# EAGLE schematic smartwing1 (EAGLE 9.6.1)
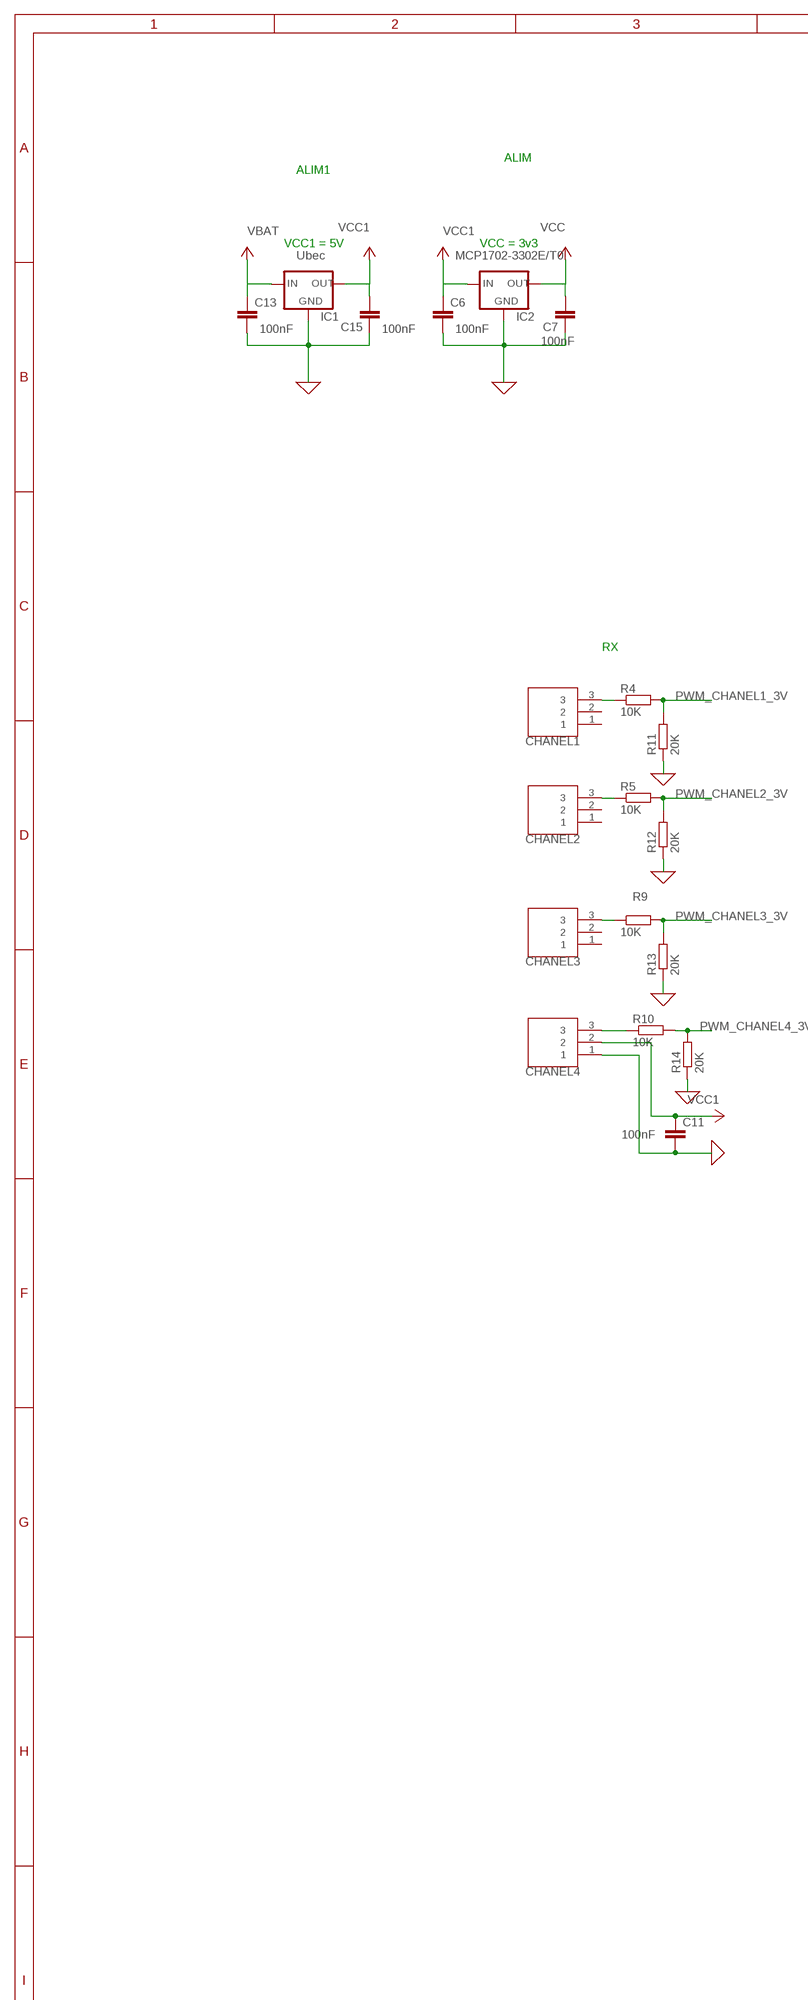
[diagram p0: schematic, sheet 1, part 1 of 2]
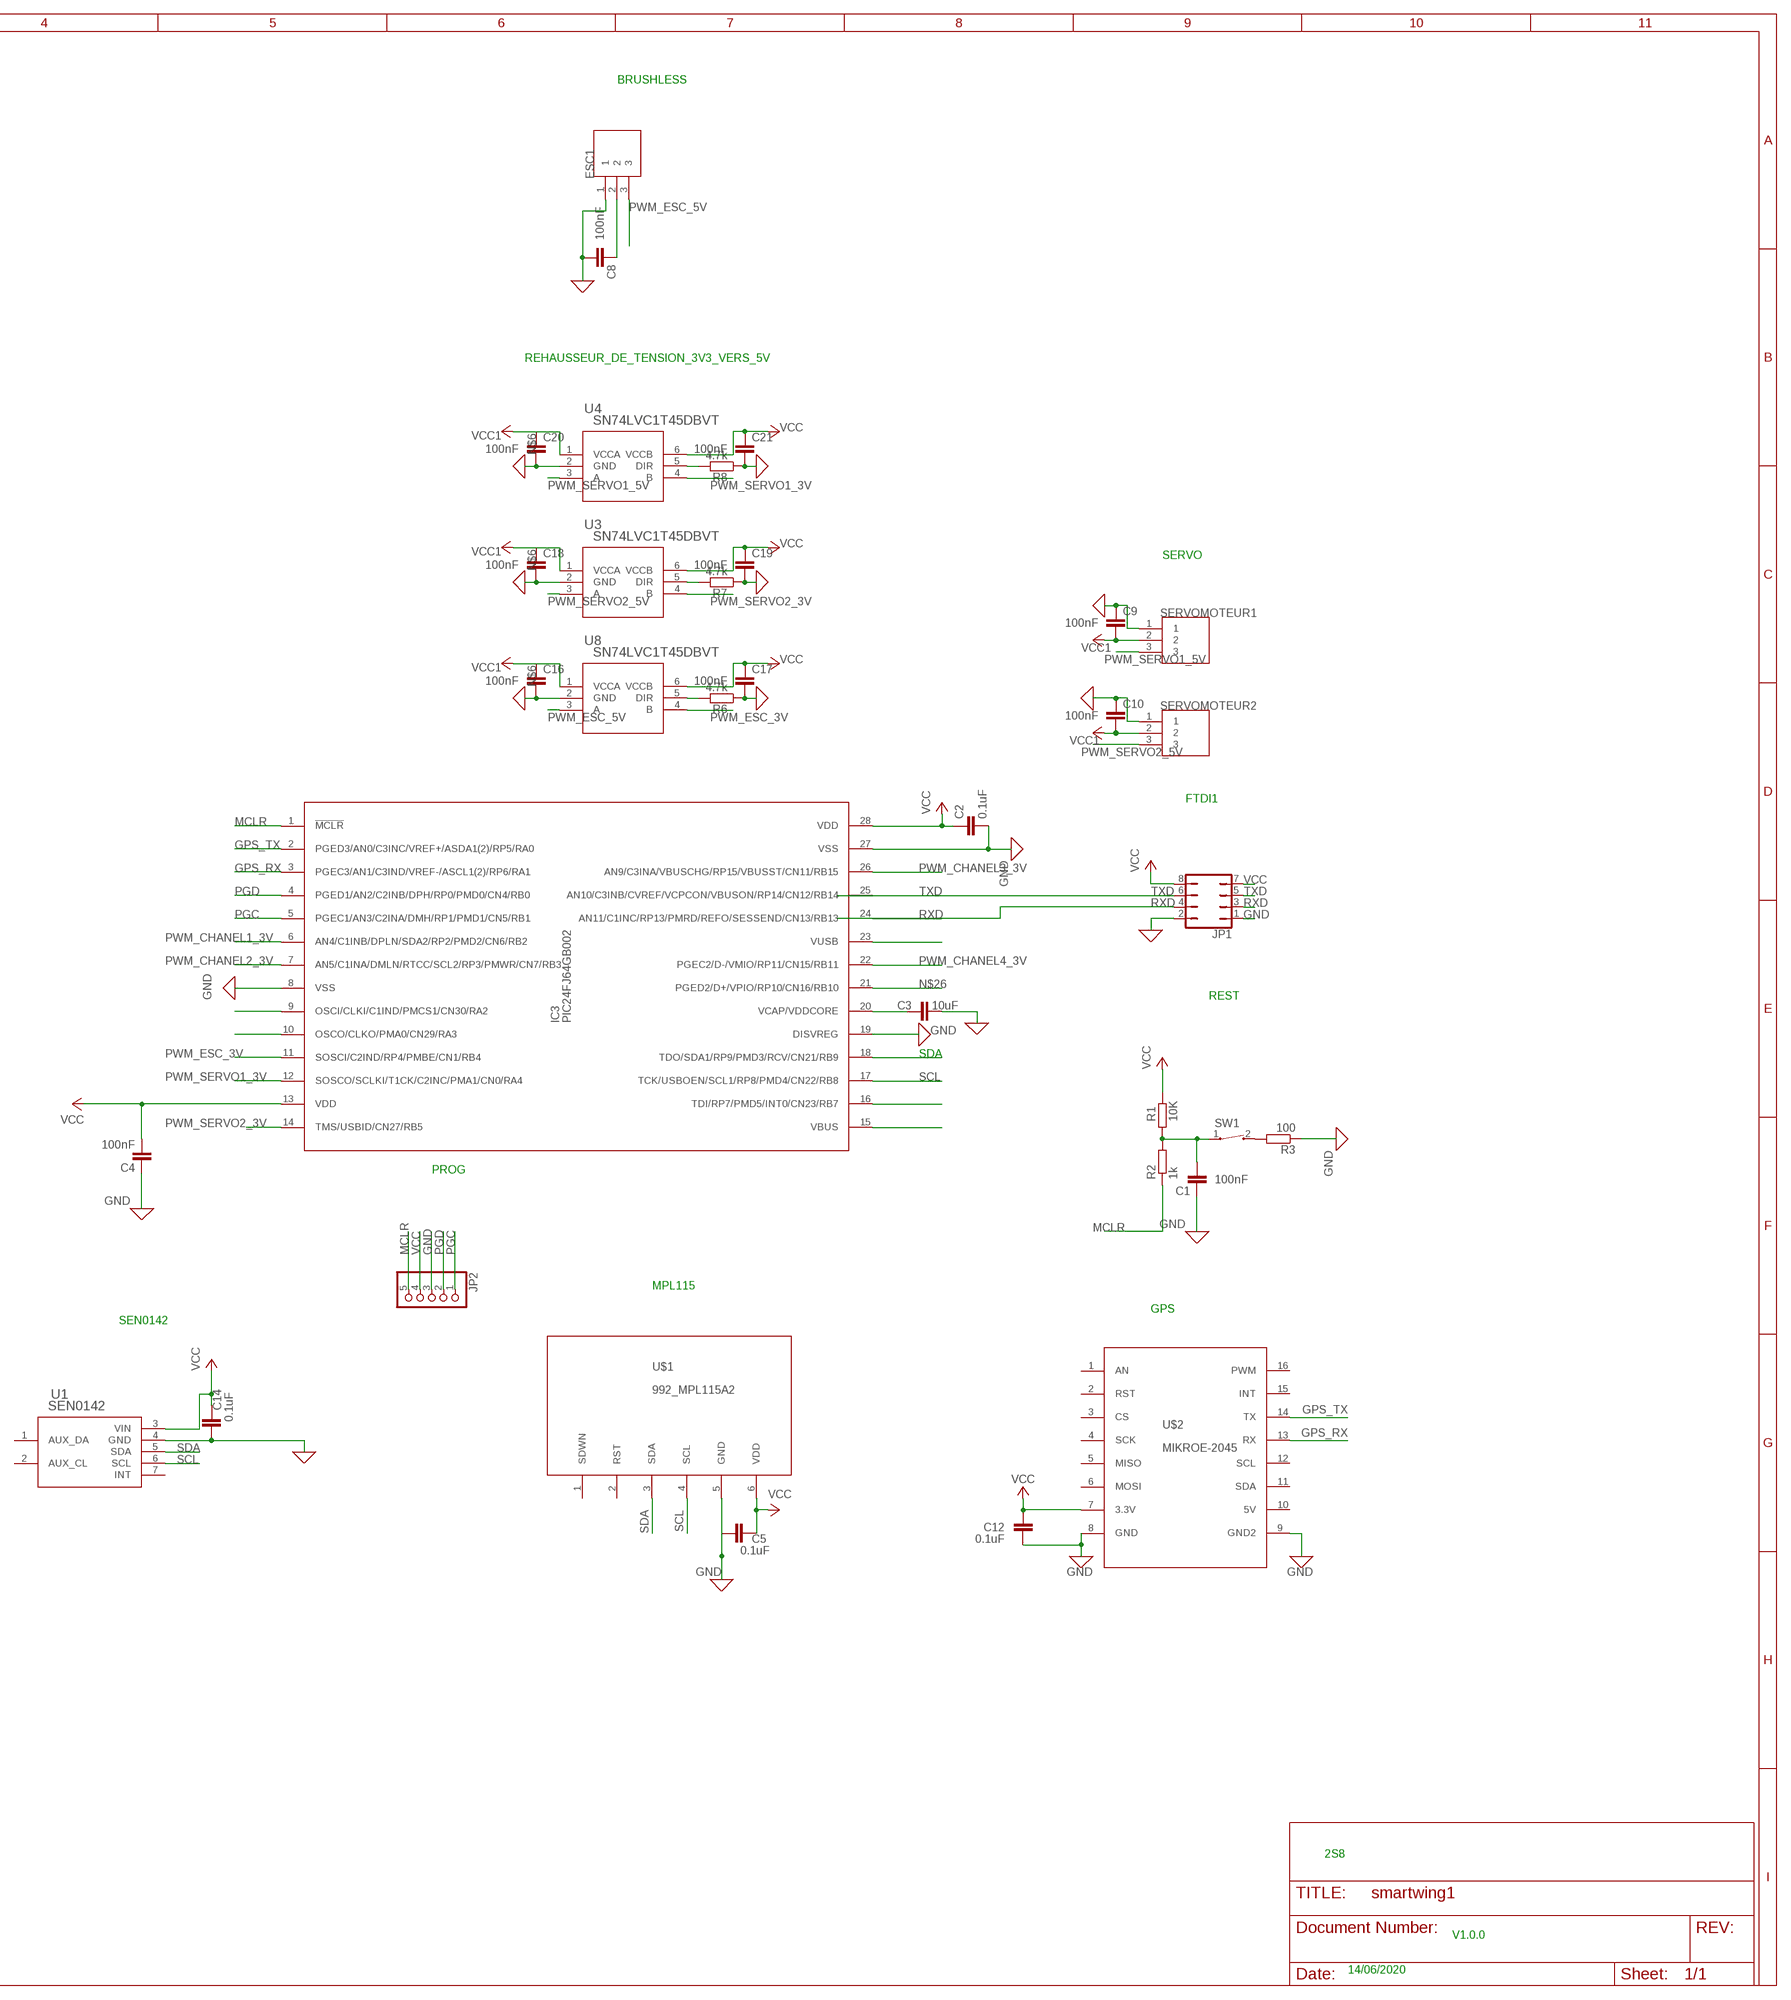
[diagram p1: schematic, sheet 1, part 2 of 2]

## Parts
C1  100nF  C-EU075-032X103  [C075-032X103]
C2  0.1uF  C-EU075-032X103  [C075-032X103]
C3  10uF  C-EU075-032X103  [C075-032X103]
C4  100nF  C-EU075-032X103  [C075-032X103]
C5  0.1uF  C-EU075-032X103  [C075-032X103]
C6  100nF  C-EU075-032X103  [C075-032X103]
C7  100nF  C-EU075-032X103  [C075-032X103]
C8  100nF  C-EU075-032X103  [C075-032X103]
C9  100nF  C-EU075-032X103  [C075-032X103]
C10  100nF  C-EU075-032X103  [C075-032X103]
C11  100nF  C-EU075-032X103  [C075-032X103]
C12  0.1uF  C-EU075-032X103  [C075-032X103]
C13  100nF  C-EU075-032X103  [C075-032X103]
C14  0.1uF  C-EU075-032X103  [C075-032X103]
C15  100nF  C-EU075-032X103  [C075-032X103]
C16  100nF  C-EU075-032X103  [C075-032X103]
C17  100nF  C-EU075-032X103  [C075-032X103]
C18  100nF  C-EU075-032X103  [C075-032X103]
C19  100nF  C-EU075-032X103  [C075-032X103]
C20  100nF  C-EU075-032X103  [C075-032X103]
C21  100nF  C-EU075-032X103  [C075-032X103]
CHANEL1  826926-3  [TE_826926-3]
CHANEL2  826926-3  [TE_826926-3]
CHANEL3  826926-3  [TE_826926-3]
CHANEL4  826926-3  [TE_826926-3]
ESC1  826926-3  [TE_826926-3]
IC1  Ubec  78LXX  [78LXX]
IC2  MCP1702-3302E/T0  78LXX  [78LXX]
IC3  PIC24FJ64GB002  [DIL28-3]
JP1  JP4Q  [JP4Q]
JP2  PINHD-1X5  [1X05]
R1  10K  R-EU_0204/5  [0204/5]
R2  1k  R-EU_0204/5  [0204/5]
R3  100  R-EU_0204/5  [0204/5]
R4  10K  R-EU_0204/5  [0204/5]
R5  10K  R-EU_0204/5  [0204/5]
R6  4.7k  R-EU_0207/7  [0207/7]
R7  4.7k  R-EU_0207/7  [0207/7]
R8  4.7k  R-EU_0207/7  [0207/7]
R9  10K  R-EU_0204/5  [0204/5]
R10  10K  R-EU_0204/5  [0204/5]
R11  20K  R-EU_0204/5  [0204/5]
R12  20K  R-EU_0204/5  [0204/5]
R13  20K  R-EU_0204/5  [0204/5]
R14  20K  R-EU_0204/5  [0204/5]
SERVOMOTEUR1  826926-3  [TE_826926-3]
SERVOMOTEUR2  826926-3  [TE_826926-3]
SW1  CT10-XXXX-A2  [CT10-XXXX-A2]
U1  SEN0142  [SEN0142]
U3  SN74LVC1T45DBVT  [DBV6_TEX]
U4  SN74LVC1T45DBVT  [DBV6_TEX]
U8  SN74LVC1T45DBVT  [DBV6_TEX]
U$1  992_MPL115A2  [1X06]
U$2  MIKROE-2045  [2X08]

## Nets
0: C3.2 C8.2 C9.1 C10.1 C11.2 C14.2 C17.2 C19.2 C21.2 CHANEL4.1 ESC1.1 JP1.2 R6.1 R7.1 R8.1 R11.1 R12.1 R13.1 R14.1 SERVOMOTEUR1.1 SERVOMOTEUR2.1 U1.4(GND) U$2.9(GND2) ; supply symbol labelled GND
100NF: C6.2 C7.1 IC2.GND ; supply symbol labelled GND
GND: C1.1 C2.2 C4.1 C5.2 C12.2 IC3.8(VSS) IC3.19(DISVREG) IC3.27(VSS) JP1.1 JP2.3 R3.1 U$1.5(GND) U$2.8(GND)
GPS_RX: IC3.3(PGEC3/AN1/C3IND/VREF-/ASCL1(2)/RP6/RA1) U$2.13(RX)
GPS_TX: IC3.2(PGED3/AN0/C3INC/VREF+/ASDA1(2)/RP5/RA0) U$2.14(TX)
MCLR: IC3.1(!MCLR) JP2.5 R2.1
N$1: IC3.16(TDI/RP7/PMD5/INT0/CN23/RB7)
N$2: C3.1 IC3.20(VCAP/VDDCORE)
N$3: C16.1 C18.1 C20.1 U3.1(VCCA) U4.1(VCCA) U8.1(VCCA) ; supply symbol labelled VCC1
N$4: R7.2 U3.5(DIR)
N$5: C1.2 R1.1 R2.2 SW1.1
N$6: C13.2 C15.1 C16.2 C18.2 C20.2 IC1.GND U3.2(GND) U4.2(GND) U8.2(GND) ; supply symbol labelled GND
N$7: R3.2 SW1.2
N$8: C7.2 C15.2 IC1.OUT IC2.OUT ; supply symbol labelled VCC, VCC1
N$9: R8.2 U4.5(DIR)
N$11: R6.2 U8.5(DIR)
N$13: C17.1 C19.1 C21.1 U3.6(VCCB) U4.6(VCCB) U8.6(VCCB) ; supply symbol labelled VCC
N$17: C4.2 IC3.13(VDD) ; supply symbol labelled VCC
N$22: IC3.15(VBUS)
N$26: IC3.21(PGED2/D+/VPIO/RP10/CN16/RB10)
N$28: IC3.23(VUSB)
PGC: IC3.5(PGEC1/AN3/C2INA/DMH/RP1/PMD1/CN5/RB1) JP2.1
PGD: IC3.4(PGED1/AN2/C2INB/DPH/RP0/PMD0/CN4/RB0) JP2.2
PWM_CHANEL1_3V: IC3.6(AN4/C1INB/DPLN/SDA2/RP2/PMD2/CN6/RB2) IC3.9(OSCI/CLKI/C1IND/PMCS1/CN30/RA2) R4.2 R11.2
PWM_CHANEL1_5V: CHANEL1.3 R4.1
PWM_CHANEL2_3V: IC3.7(AN5/C1INA/DMLN/RTCC/SCL2/RP3/PMWR/CN7/RB3) IC3.10(OSCO/CLKO/PMA0/CN29/RA3) R5.2 R12.2
PWM_CHANEL2_5V: CHANEL2.3 R5.1
PWM_CHANEL3_3V: IC3.26(AN9/C3INA/VBUSCHG/RP15/VBUSST/CN11/RB15) R9.2 R13.2
PWM_CHANEL3_5V: CHANEL3.3 R9.1
PWM_CHANEL4_3V: IC3.22(PGEC2/D-/VMIO/RP11/CN15/RB11) R10.2 R14.2
PWM_CHANEL4_5V: CHANEL4.3 R10.1
PWM_ESC_3V: IC3.11(SOSCI/C2IND/RP4/PMBE/CN1/RB4) U8.4(B)
PWM_ESC_5V: ESC1.3 U8.3(A)
PWM_SERVO1_3V: IC3.12(SOSCO/SCLKI/T1CK/C2INC/PMA1/CN0/RA4) U4.4(B)
PWM_SERVO1_5V: SERVOMOTEUR1.3 U4.3(A)
PWM_SERVO2_3V: IC3.14(TMS/USBID/CN27/RB5) U3.4(B)
PWM_SERVO2_5V: SERVOMOTEUR2.3 U3.3(A)
RXD: IC3.24(AN11/C1INC/RP13/PMRD/REFO/SESSEND/CN13/RB13) JP1.3 JP1.4
SCL: IC3.17(TCK/USBOEN/SCL1/RP8/PMD4/CN22/RB8) U1.6(SCL) U$1.4(SCL)
SDA: IC3.18(TDO/SDA1/RP9/PMD3/RCV/CN21/RB9) U1.5(SDA) U$1.3(SDA)
TXD: IC3.25(AN10/C3INB/CVREF/VCPCON/VBUSON/RP14/CN12/RB14) JP1.5 JP1.6
VBAT: C13.1 IC1.IN ; supply symbol labelled VCC
VCC: C2.1 C5.1 C12.1 C14.1 IC3.28(VDD) JP1.7 JP1.8 JP2.4 R1.2 U1.3(VIN) U$1.6(VDD) U$2.7(3.3V)
VCC1: C6.1 C8.1 C9.2 C10.2 C11.1 CHANEL4.2 ESC1.2 IC2.IN SERVOMOTEUR1.2 SERVOMOTEUR2.2 ; supply symbol labelled VCC
Unconnected: CHANEL1.1 CHANEL1.2 CHANEL2.1 CHANEL2.2 CHANEL3.1 CHANEL3.2 U1.1(AUX_DA) U1.2(AUX_CL) U1.7(INT) U$1.1(SDWN) U$1.2(RST) U$2.1(AN) U$2.2(RST) U$2.3(CS) U$2.4(SCK) U$2.5(MISO) U$2.6(MOSI) U$2.10(5V) U$2.11(SDA) U$2.12(SCL) U$2.15(INT) U$2.16(PWM)

## Notes on the sheet
- BRUSHLESS
- ALIM
- ALIM1
- VCC1 = 5V | VCC = 3v3
- 100nF | 100nF | 100nF
- 100nF
- REHAUSSEUR_DE_TENSION_3V3_VERS_5V
- SERVO
- RX
- FTDI1
- REST
- PROG
- MPL115
- GPS
- SEN0142
- 2S8
- V1.0.0
- 14/06/2020

## Library data of the parts
C1-C21 = rcl:C-EU: CAPACITOR, European symbol; SPICEPREFIX: C
CHANEL1-CHANEL4 ESC1 SERVOMOTEUR2 = 826926-3:826926-3: 12P MOD2 STIFT LEI; AVAILABILITY: Unavailable; CENTERLINE_PITCH: 2.54 mm[.1 in]; COMMENT: 826926-3; DESCRIPTION: Pin header; pin strips; AMPMODU MOD II; male; PIN: 3; straight; DIGIKEY-PURCHASE-URL: https://snapeda.com/shop?store=DigiKey&id=442070; EU_ROHS_COMPLIANCE: Compliant; MF: TE Connectivity; MP: 826926-3; NUMBER_OF_POSITIONS: 3; PACKAGE: None; PRICE: None; PRODUCT_TYPE: Connector
IC1 IC2 = v-reg:78LXX: VOLTAGE REGULATOR
IC3 = CustomPIC2:PIC24FJ64GB002: PIC24FJ64GA002 edit this description Auto generated by make-symbol-device-package-bsdl.ulp Rev. 25 Source: PIC24FJ64GA002.bsd; MPN: PIC24FJ64GA002-I/SP; OC_FARNELL: 1332298; OC_NEWARK: 88K6132
JP1 = jumper:JP4Q: JUMPER
JP2 = pinhead:PINHD-1X5: PIN HEADER
R1-R14 = rcl:R-EU_: RESISTOR, European symbol; SPICEPREFIX: R
SERVOMOTEUR1 = 826926-3:826926-3: 12P MOD2 STIFT LEI; AVAILABILITY: Unavailable; CENTERLINE_PITCH: 2.54 mm[.1 in]; COMMENT: 826926-3; DESCRIPTION: Pin header; pin strips; AMPMODU MOD II; male; PIN: 3; straight; DIGIKEY-PURCHASE-URL: https://snapeda.com/shop?store=DigiKey&id=442070; EU_ROHS_COMPLIANCE: Compliant; MF: TE Connectivity; MP: 826926-3; NUMBER_OF_POSITIONS: 3; PACKAGE: None; PRICE: None; PRODUCT_TYPE: Connector; SPICEPREFIX: J
SW1 = switch-coto:CT10-XXXX-: CT10 Series Molded Switch Source: www.cotorelay.com .. Coto_Technology__CT10-1530-G1.pdf
U1 = MPU6050:SEN0142
U3 U4 U8 = NEWCUSTOM:SN74LVC1T45DBVT; BUILT_BY: EMA_UL_Team; MANUFACTURER: Texas Instruments; MANUFACTURER_PART_NUMBER: SN74LVC1T45DBVT; SOURCELIBRARY: TI_2014-08-19; VENDOR: Texas Instruments
U$1 = 2S_AW_lib:992_MPL115A2
U$2 = 2S_AW_lib:MIKROE-2045